# EAGLE design layer1v2 (EAGLE 7.6.0)
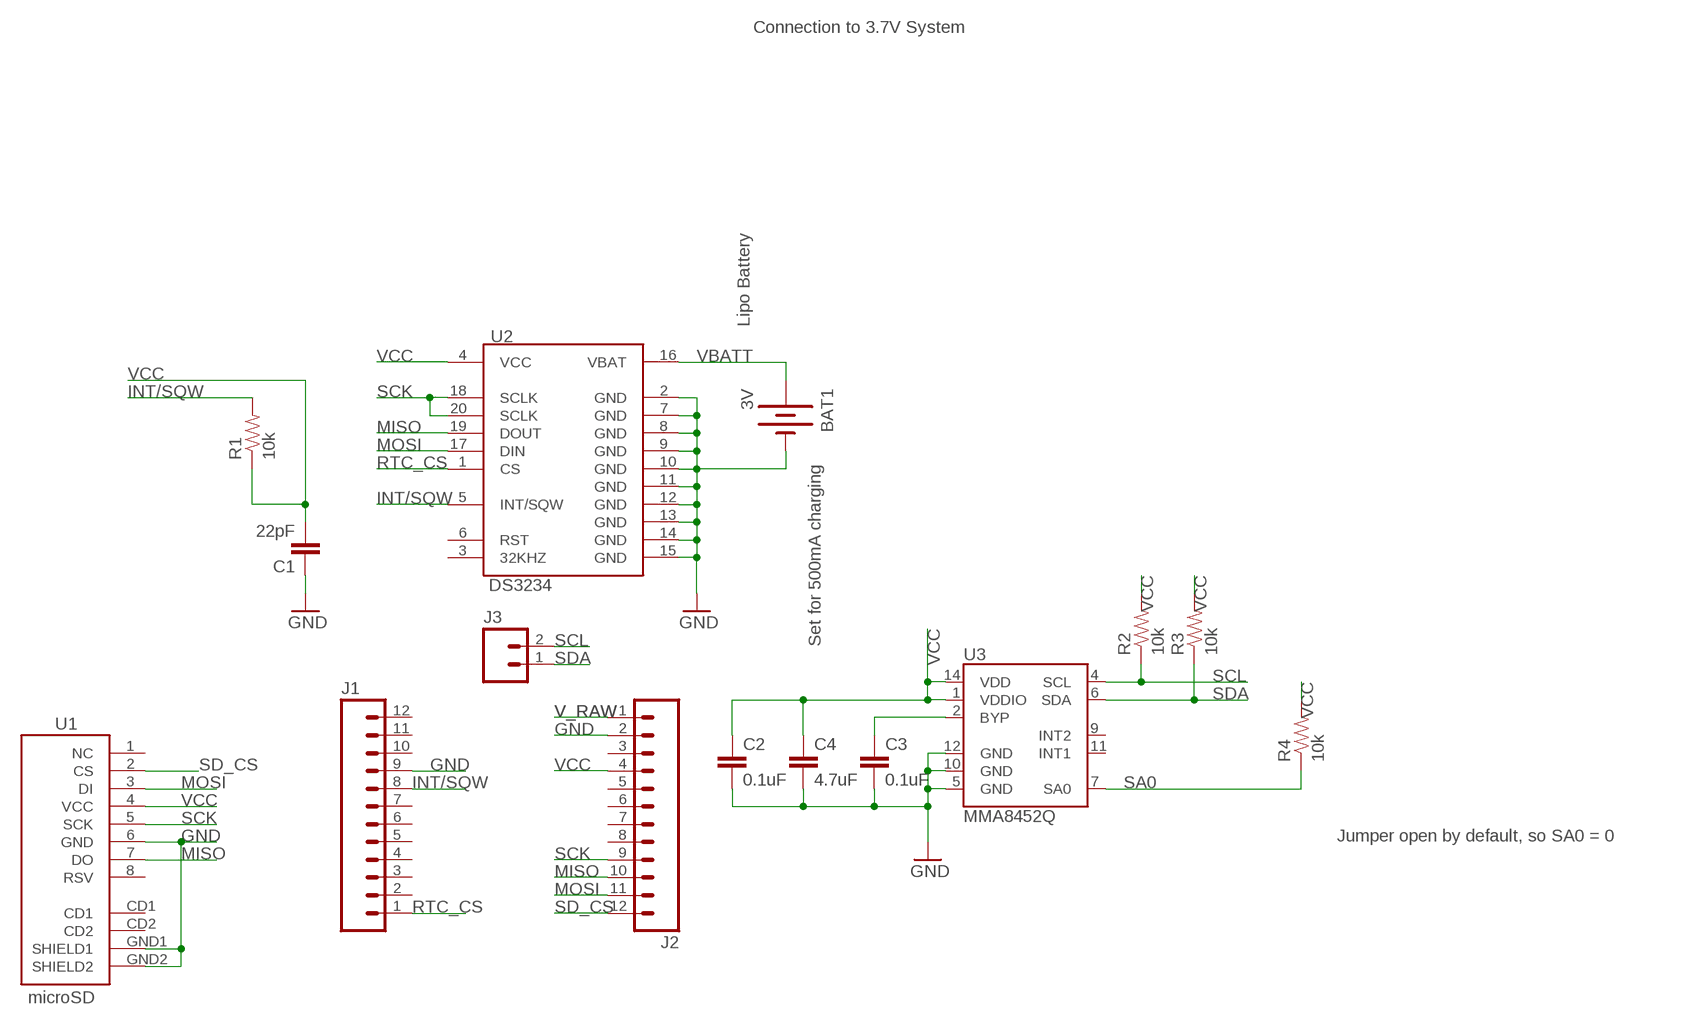
[diagram p0: schematic, sheet 1]

## Parts
BAT1  3V  BATTERY  [BATTCON_12MM_CURVED]
C1  22pF  CAP0402-CAP  [0402-CAP]
C2  0.1uF  CAP0402-CAP  [0402-CAP]
C3  0.1uF  CAP0402-CAP  [0402-CAP]
C4  4.7uF  CAP0402-CAP  [0402-CAP]
J1  M12PTH  [1X12]
J2  M12PTH  [1X12]
J3  M02LOCK  [1X02_LOCK]
R1  10k  RESISTOR0402-RES  [0402-RES]
R2  10k  RESISTOR0402-RES  [0402-RES]
R3  10k  RESISTOR0402-RES  [0402-RES]
R4  10k  RESISTOR0402-RES  [0402-RES]
U1  microSD  USD-SOCKETSMD  [MICRO-SD-SOCKET-PP]
U2  DS3234  [DS3234]
U3  MMA8452Q  [QFN-16_0.5MM]

## Nets
BYP: C3.1 U3.2(BYP)
GND: BAT1.GND(-) C1.1 C2.2 C3.2 C4.2 J1.9 J2.2 U1.6(GND) U1.GND1(SHIELD1) U1.GND2(SHIELD2) U2.2(GND) U2.7(GND) U2.8(GND) U2.9(GND) U2.10(GND) U2.11(GND) U2.12(GND) U2.13(GND) U2.14(GND) U2.15(GND) U3.5(GND) U3.10(GND) U3.12(GND)
INT/SQW: J1.8 R1.2 U2.5(INT/SQW)
MISO: J2.10 U1.7(DO) U2.19(DOUT)
MOSI: J2.11 U1.3(DI) U2.17(DIN)
RTC_CS: J1.1 U2.1(CS)
SA0: R4.1 U3.7(SA0)
SCK: J2.9 U1.5(SCK) U2.18(SCLK) U2.20(SCLK)
SCL: J3.2 R2.1 U3.4(SCL)
SD_CS: J2.12 U1.2(CS)
SDA: J3.1 R3.1 U3.6(SDA)
V_RAW: J2.1
VBATT: BAT1.PWR@1(+) U2.16(VBAT)
VCC: C1.2 C2.1 C4.1 J2.4 R1.1 R2.2 R3.2 R4.2 U1.4(VCC) U2.4(VCC) U3.1(VDDIO) U3.14(VDD)
Unconnected: J1.2 J1.3 J1.4 J1.5 J1.6 J1.7 J1.10 J1.11 J1.12 J2.3 J2.5 J2.6 J2.7 J2.8 U1.1(NC) U1.8(RSV) U1.CD1 U1.CD2 U2.3(32KHZ) U2.6(RST) U3.9(INT2) U3.11(INT1)

## Notes on the sheet
- Connection to 3.7V System
- Lipo Battery
- Set for 500mA charging
- Jumper open by default, so SA0 = 0

## Library data of the parts
BAT1 = SparkFun:BATTERY: Battery Holders Various common sizes : AA, AAA, 20mm coin cell and 12mm coin cell.
C1-C4 = SparkFun:CAP: Capacitor Standard 0603 ceramic capacitor, and 0.1" leaded capacitor.
J1 J2 = SparkFun-Connectors:M12: Header 12 Standard 12-pin 0.1" header. Use with straight break away headers (SKU : PRT-00116), right angle break away headers (PRT-00553), swiss pins (PRT-00743), machine pins (PRT-00117), and female headers (PRT-00115).
J3 = SparkFun-Connectors:M02: Standard 2-pin 0.1" header. Use with - straight break away headers ( PRT-00116) - right angle break away headers (PRT-00553) - swiss pins (PRT-00743) - machine pins (PRT-00117) - female headers (PRT-00115) Molex polarized connector foot print use with: PRT-08233 with associated crimp pins and housings. 2.54_SCREWTERM for use with PRT-10571. 3.5mm Screw Terminal footprints for PRT-08084 5mm Screw Terminal footprints for use with PRT-08432
R1-R4 = SparkFun:RESISTOR: Resistor Basic schematic elements and footprints for 0603, 1206, and PTH resistors.
U1 = SparkFun:USD-SOCKET: microSD Socket Push-push type uSD socket. Schematic element and footprint production proven. Spark Fun Electronics SKU : PRT-00127. tDoc lines correctly indicate media card edge positions when inserting (unlocked, locked, depressed).
U2 = SparkFun:DS3234: DS3234 Real Time Clock
U3 = SparkFun:MMA8452Q: MMA8452Q 3-Axis, 12/8-bit Digital Accelerometer Supply Voltage: 1.6-3.6V Range: +/- 2g, 4g, 8g Interface: I2C, 12-bit and 8-bit ODR: 1.56 Hz - 800 Hz Package: QFN-16 http://cache.freescale.com/files/sensors/doc/data_sheet/MMA8452Q.pdf

## Board
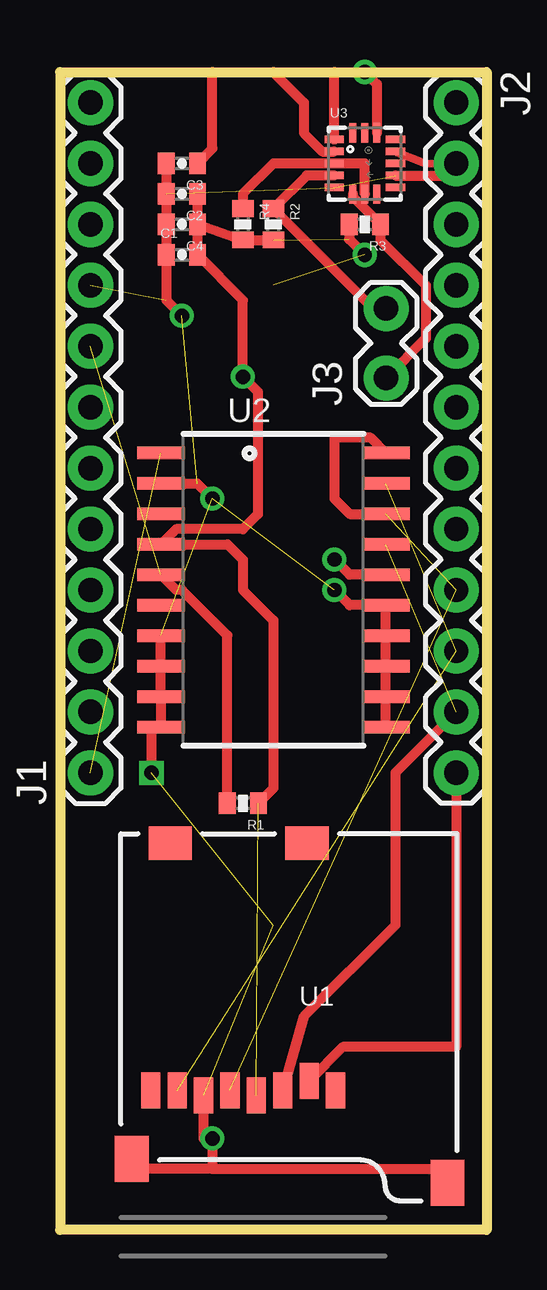
[diagram p1: board, top side]
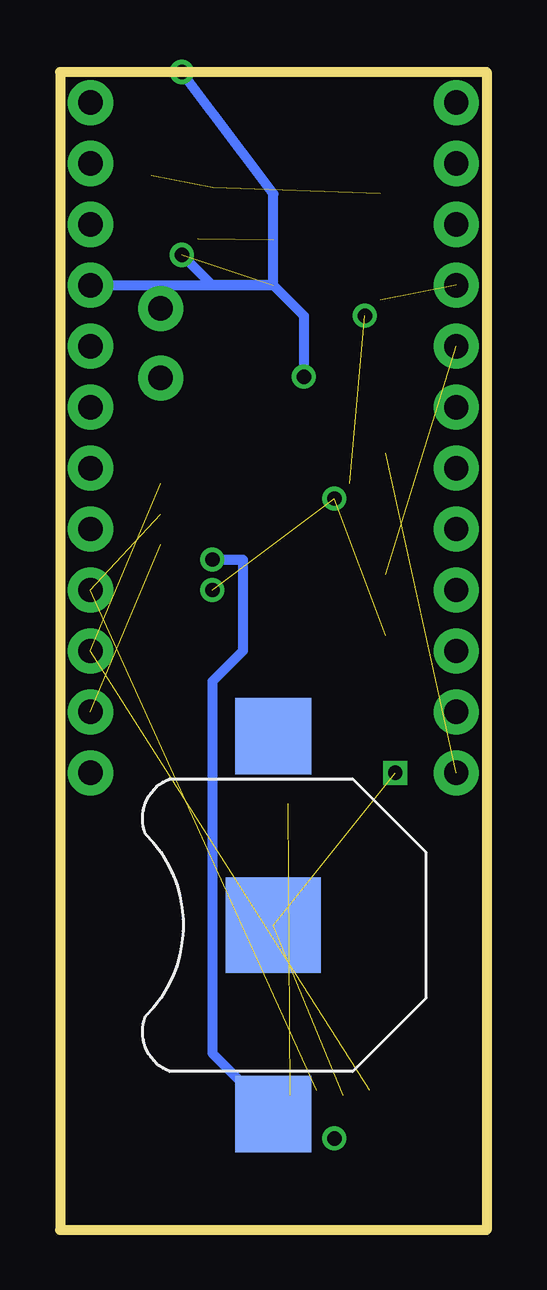
[diagram p2: board, bottom side, seen from below]

Size 17.78 x 48.26 mm. Coordinates in mm from the lower left corner, seen from the top.
Outline: 0,48.26 17.78,48.26 17.78,0 0,0 0,48.26
Copper layers (1*16): Top 0.035mm / dielectric 1.5mm / Bottom 0.035mm
Design rules "default": minimum track width 10mil, minimum drill 24mil, track to track 8mil, track to pad 8mil, pad to pad 8mil, via to via 8mil, smd to smd 8mil, copper to edge 40mil, drill to drill 8mil, minimum pad ring 10mil, minimum via ring 8mil, stop-mask expansion 4mil, vias tented up to drill 0mil, thermal gap 10mil

### Footprints (pad centres in the part's own frame; a part is rotated, then mirrored left to right if it is on the bottom)
BATTCON_12MM_CURVED = smd 3.962 x 3.962: GND 0,0 | smd 3.175 x 3.175: PWR@1 -7.874,0; PWR@2 7.874,0
0402-CAP = smd 0.7 x 0.9: 1 -0.65,0; 2 0.65,0
1X12 = drill 1.016 pad 1.88: 1 0,0; 2 2.54,0; 3 5.08,0; 4 7.62,0; 5 10.16,0; 6 12.7,0; 7 15.24,0; 8 17.78,0; 9 20.32,0; 10 22.86,0; 11 25.4,0; 12 27.94,0
1X02_LOCK = drill 1.016 pad 1.88: 1 -0.178,0; 2 2.718,0
0402-RES = smd 0.7 x 0.9: 1 -0.65,0; 2 0.65,0
MICRO-SD-SOCKET-PP = smd 0.8 x 1.5: 1 -8.94,10.7; 2 -7.84,10.3; 3 -6.74,10.7; 4 -5.64,10.9; 5 -4.54,10.7; 6 -3.44,10.9; 7 -2.34,10.7; 8 -1.24,10.7 | smd 1.8 x 1.4: CD1 -7.75,0.4; CD2 -2.05,0.4 | smd 1.4 x 1.9: GND1 -13.6,14.55; GND2 -0.45,13.55
DS3234 = smd 0.53 x 1.98: 1 -5.715,-4.685; 2 -4.445,-4.685; 3 -3.175,-4.685; 4 -1.905,-4.685; 5 -0.635,-4.685; 6 0.635,-4.685; 7 1.905,-4.685; 8 3.175,-4.685; 9 4.445,-4.685; 10 5.715,-4.685; 11 5.715,4.685; 12 4.445,4.685; 13 3.175,4.685; 14 1.905,4.685; 15 0.635,4.685; 16 -0.635,4.685; 17 -1.905,4.685; 18 -3.175,4.685; 19 -4.445,4.685; 20 -5.715,4.685
QFN-16_0.5MM = smd 0.8 x 0.3: 1 -1.275,1; 2 -1.275,0.5; 3 -1.275,0; 4 -1.275,-0.5; 5 -1.275,-1; 9 1.275,-1; 10 1.275,-0.5; 11 1.275,0; 12 1.275,0.5; 13 1.275,1 | smd 0.3 x 0.8: 6 -0.5,-1.275; 7 0,-1.275; 8 0.5,-1.275; 14 0.5,1.275; 15 0,1.275; 16 -0.5,1.275

### Placement (x,y rotation side)
BAT1  8.89,12.7 90 bottom
C1  5.08,40.64 0 top
C2  5.08,43.18 180 top
C3  5.08,44.45 180 top
C4  5.08,41.91 180 top
J1  1.27,19.05 90 top
J2  16.51,46.99 270 top
J3  13.59,35.69 90 top
R1  7.62,17.78 180 top
R2  8.89,41.91 270 top
R3  12.7,41.91 180 top
R4  7.62,41.91 270 top
U1  2.54,16.51 180 top
U2  8.89,26.67 270 top
U3  12.7,44.45 0 top

### Tracks (layer width: path | path; a pad name or v marks a point on that pad's centre or on a via)
BYP
  Top 0.406: C3.1 6.35,45.07 6.35,48.26 8.89,48.26 10.16,46.99 10.16,45.72 10.93,44.95 U3.2
GND  (via drill 0.6)  (8 unrouted)
  Top 0.305: J2.2 15.24,44.45 U3.12
  Top 0.406: 6.35,2.54 2.99,2.54 U1.GND2 | 6.35,2.54 v6.35,3.81 5.98,3.81 U1.6 | 6.35,2.54 16.14,2.54 U1.GND1 | v3.81,19.05 3.81,20.96 U2.10 U2.9 U2.8 U2.7 | U2.11 U2.12 U2.13 U2.14 U2.15 12.06,26.04 v11.43,26.67 | U2.2 5.71,31.11 v6.35,30.48 | C3.2 C2.2 C4.2 C1.1 4.43,38.75 v5.08,38.1 | U3.10 16.51,43.95 J2.2
INT/SQW  (1 unrouted)
  Top 0.406: R1.2 6.97,24.78 5.08,26.67 4.84,26.67 U2.5
MISO  (2 unrouted)
MOSI  (1 unrouted)
  Top 0.406: J2.11 13.97,19.05 13.97,12.7 10.16,8.89 U1.3
N$1  (1 unrouted)
  Bottom 0.406: 8.89,39.37 11.43,39.37 12.7,40.64
N$3  (via drill 0.6)
  other vias: 7.62,35.56
RTC_CS  (1 unrouted)
SA0
  Top 0.406: U3.7 12.7,44.45 8.89,44.45 7.62,43.18 R4.1
SCK  (2 unrouted)
  Top 0.406: U2.20 12.94,33.02 11.43,33.02 11.43,30.48 12.06,29.84 U2.18
SCL
  Top 0.406: U3.4 10.28,43.95 R2.1 13.04,38.4 J3.2
SD_CS
  Top 0.406: J2.12 16.51,7.62 11.79,7.62 U1.2
SDA
  Top 0.406: U3.6 12.2,43.06 R3.1 13.35,41.26 15.24,39.37 15.24,37.16 J3.1
VBATT  (via drill 0.6)
  Top 0.406: U2.16 12.06,27.3 v11.43,27.94
  Bottom 0.406: v11.43,27.94 10.16,27.94 10.16,24.13 11.43,22.86 11.43,7.37 BAT1.PWR@1
VCC  (via drill 0.6)  (2 unrouted)
  Top 0.406: C4.1 R4.2 R2.2 | C1.2 5.73,40.61 | 8.26,17.8 R1.1 8.89,18.4 8.89,25.4 7.62,26.67 7.62,27.94 6.99,28.57 U2.4 4.84,29.21 7.62,29.21 8.24,29.83 8.24,34.94 v7.62,35.56 7.62,38.75 C1.2 | C1.2 C4.1 | C4.1 C2.1 | U3.14 13.2,47.76 v12.7,48.26 11.43,48.26 U3.1 | R3.2 12.05,41.29 v12.7,40.64
  Bottom 0.406: J2.4 8.89,39.37 | 8.89,39.37 8.89,43.18 v12.7,48.26 | 8.89,39.37 7.62,38.1 v7.62,35.56